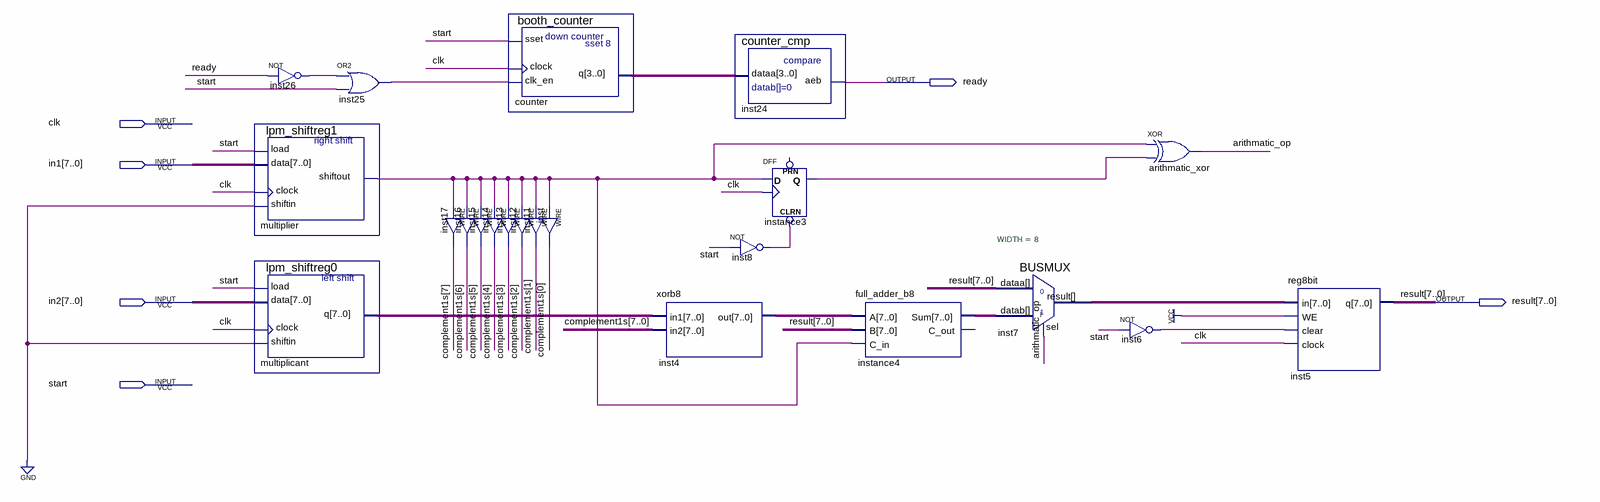
[diagram p0: schematic sheet]
// Quartus schematic booth_multiplier.bdf as structural Verilog: 22 symbols, 6 pins
module booth_multiplier (
  input  clk,
  input  [7:0] in1,
  input  [7:0] in2,
  input  start,
  output ready,
  output [7:0] result
);

  wire arithmatic_op, inst6_out, inst8_out, inst25_out, inst26_out, instance3_q, multiplier_shiftout;
  wire [3:0] counter_q;
  wire [7:0] complement1s, inst4_out, inst7_result, instance4_sum, multiplicant_q;

  not inst26 (inst26_out, ready);
  lpm_shiftreg1 multiplier (.load(start), .data(in1), .clock(clk), .shiftin(1'b0), .shiftout(multiplier_shiftout));
  lpm_shiftreg0 multiplicant (.load(start), .data(in2), .clock(clk), .shiftin(1'b0), .q(multiplicant_q));
  or inst25 (inst25_out, inst26_out, start);
  assign complement1s[6] = multiplier_shiftout;  // WIRE inst16
  assign complement1s[7] = multiplier_shiftout;  // WIRE inst17
  booth_counter counter (.sset(start), .clock(clk), .clk_en(inst25_out), .q(counter_q));
  assign complement1s[2] = multiplier_shiftout;  // WIRE inst12
  assign complement1s[3] = multiplier_shiftout;  // WIRE inst13
  assign complement1s[4] = multiplier_shiftout;  // WIRE inst14
  assign complement1s[5] = multiplier_shiftout;  // WIRE inst15
  assign complement1s[0] = multiplier_shiftout;  // WIRE inst
  assign complement1s[1] = multiplier_shiftout;  // WIRE inst11
  xorb8 inst4 (.in1(multiplicant_q), .in2(complement1s), .out(inst4_out));
  not inst8 (inst8_out, start);
  counter_cmp inst24 (.dataa(counter_q), .aeb(ready));
  DFF instance3 (.CLRN(inst8_out), .CLK(clk), .D(multiplier_shiftout), .Q(instance3_q));  // open: PRN
  full_adder_b8 instance4 (.A(inst4_out), .B(result), .C_in(multiplier_shiftout), .Sum(instance4_sum));  // open: C_out
  BUSMUX #(.WIDTH(8)) inst7 (.datab(instance4_sum), .sel(arithmatic_op), .dataa(result), .result(inst7_result));
  xor arithmatic_xor (arithmatic_op, multiplier_shiftout, instance3_q);
  not inst6 (inst6_out, start);
  reg8bit inst5 (.in(inst7_result), .WE(1'b1), .clear(inst6_out), .clock(clk), .q(result));
endmodule
